# EAGLE design SUSTAINA-SBC-Power-Board (EAGLE 9.6.2)
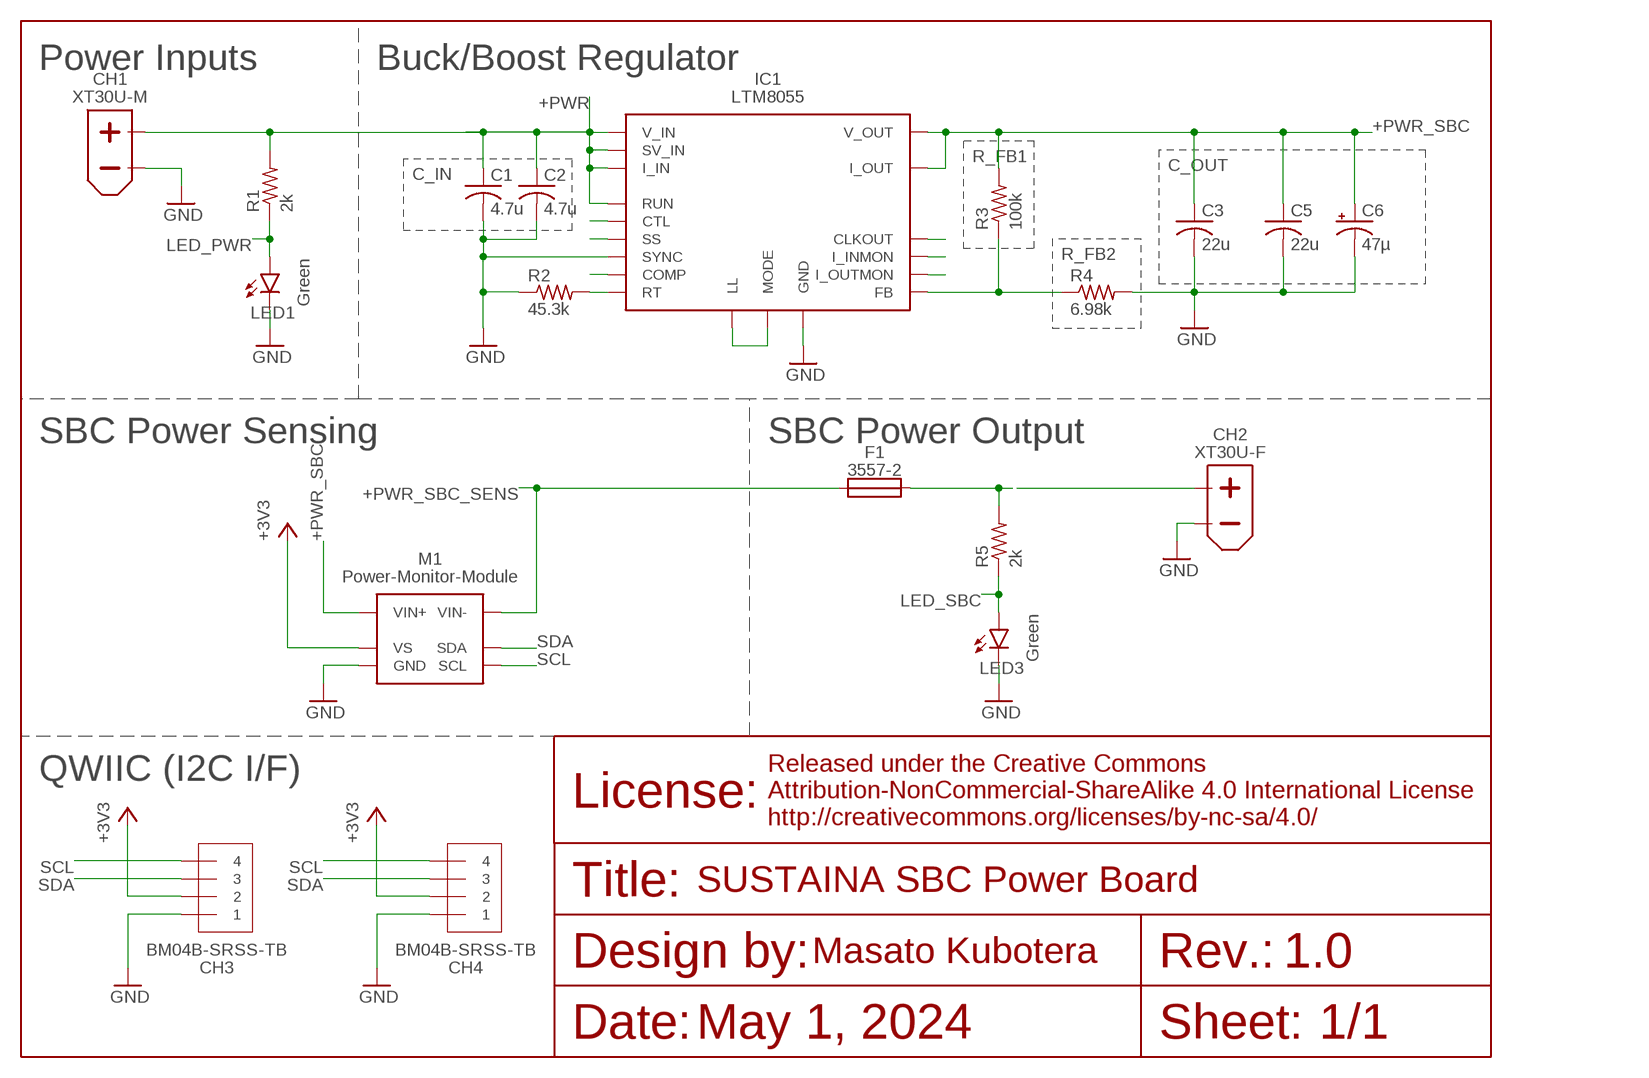
[diagram p0: schematic, sheet 1]

## Parts
C1  4.7u  C-USC0805  [C0805]
C2  4.7u  C-USC0805  [C0805]
C3  22u  C-USC0805  [C0805]
C5  22u  C-USC0805  [C0805]
C6  47µ  CPOL-USD/7343-31R  [D/7343-31R]
CH1  XT30U-M  [XT30U-M]
CH2  XT30U-F  [XT30U-F]
CH3  BM04B-SRSS-TB  [BM04B-SRSS-TB]
CH4  BM04B-SRSS-TB  [BM04B-SRSS-TB]
F1  3557-2  [3557-2]
IC1  LTM8055  [LTM8055]
LED1  Green  LEDSML0603  [SML0603]
LED3  Green  LEDSML0603  [SML0603]
M1  POWER-MONITOR-MODULE  [POWER-MONITOR-MODULE]
R1  2k  R-US_R0603  [R0603]
R2  45.3k  R-US_R0603  [R0603]
R3  100k  R-US_R0603  [R0603]
R4  6.98k  R-US_R0603  [R0603]
R5  2k  R-US_R0603  [R0603]

## Nets
+3V3 [low-power]: CH3.2 CH4.2 M1.VS
+PWR [power]: C1.1 C2.1 CH1.+ IC1.F10(SV_IN) IC1.F11(SV_IN) IC1.G10(V_IN) IC1.G11(V_IN) IC1.H10(V_IN) IC1.H11(V_IN) IC1.J10(V_IN) IC1.J11(V_IN) IC1.K10(V_IN) IC1.K11(V_IN) IC1.L4(RUN) IC1.L9(I_IN) IC1.L10(V_IN) IC1.L11(V_IN) R1.2
+PWR_SBC [power]: C3.1 C5.1 C6.+ IC1.A1(V_OUT) IC1.A2(V_OUT) IC1.A3(V_OUT) IC1.A4(V_OUT) IC1.A5(V_OUT) IC1.A6(V_OUT) IC1.B1(V_OUT) IC1.B2(V_OUT) IC1.B3(V_OUT) IC1.B4(V_OUT) IC1.B5(V_OUT) IC1.B6(V_OUT) IC1.C1(V_OUT) IC1.C2(V_OUT) IC1.C3(V_OUT) IC1.C4(V_OUT) IC1.C5(V_OUT) IC1.C6(V_OUT) IC1.D1(I_OUT) M1.VIN+1(VIN+) M1.VIN+2(VIN+) M1.VIN+3(VIN+) M1.VIN+4(VIN+) M1.VIN+5(VIN+) M1.VIN+6(VIN+) M1.VIN+7(VIN+) M1.VIN+8(VIN+) M1.VIN+9(VIN+) M1.VIN+10(VIN+) R3.2
+PWR_SBC_OUT [power]: CH2.+ F1.3 F1.4 R5.2
+PWR_SBC_SENS [power]: F1.1 F1.2 M1.VIN-1(VIN-) M1.VIN-2(VIN-) M1.VIN-3(VIN-) M1.VIN-4(VIN-) M1.VIN-5(VIN-) M1.VIN-6(VIN-) M1.VIN-7(VIN-) M1.VIN-8(VIN-) M1.VIN-9(VIN-) M1.VIN-10(VIN-)
CLKOUT [signal]: IC1.G1(CLKOUT)
COMP [signal]: IC1.J2(COMP)
FB [signal]: IC1.J1(FB) R3.1 R4.1
GND [power]: C1.2 C2.2 C3.2 C5.2 C6.- CH1.- CH2.- CH3.1 CH4.1 IC1.A7(GND) IC1.A8(GND) IC1.A9(GND) IC1.A10(GND) IC1.A11(GND) IC1.B7(GND) IC1.B8(GND) IC1.B9(GND) IC1.B10(GND) IC1.B11(GND) IC1.C7(GND) IC1.C8(GND) IC1.C9(GND) IC1.C10(GND) IC1.C11(GND) IC1.D2(GND) IC1.D3(GND) IC1.D4(GND) IC1.D5(GND) IC1.D6(GND) IC1.D7(GND) IC1.D8(GND) IC1.D9(GND) IC1.D10(GND) IC1.D11(GND) IC1.E1(GND) IC1.E2(GND) IC1.E3(GND) IC1.E4(GND) IC1.E5(GND) IC1.E6(GND) IC1.E7(GND) IC1.E8(GND) IC1.E9(GND) IC1.E10(GND) IC1.E11(GND) IC1.F2(GND) IC1.F3(GND) IC1.F4(GND) IC1.F5(GND) IC1.F6(GND) IC1.F7(GND) IC1.F8(GND) IC1.F9(GND) IC1.G3(GND) IC1.G4(GND) IC1.G5(GND) IC1.G6(GND) IC1.G7(GND) IC1.G8(GND) IC1.G9(GND) IC1.H2(SYNC) IC1.H3(GND) IC1.H4(GND) IC1.H5(GND) IC1.H6(GND) IC1.H7(GND) IC1.H8(GND) IC1.H9(GND) IC1.J3(GND) IC1.J4(GND) IC1.J5(GND) IC1.J6(GND) IC1.J7(GND) IC1.J8(GND) IC1.J9(GND) IC1.K3(GND) IC1.K4(GND) IC1.K5(GND) IC1.K6(GND) IC1.K7(GND) IC1.K8(GND) IC1.K9(GND) IC1.L1(GND) IC1.L5(GND) IC1.L6(GND) IC1.L7(GND) IC1.L8(GND) LED1.C LED3.C M1.GND R2.1 R4.2
I_INMON [signal]: IC1.L3(I_INMON)
I_OUTMON [signal]: IC1.L2(I_OUTMON)
LED_PWR [low-power]: LED1.A R1.1
LED_SBC [low-power]: LED3.A R5.1
MODE [signal]: IC1.F1(LL) IC1.G2(MODE)
RT [signal]: IC1.H1(RT) R2.2
SCL [signal]: CH3.4 CH4.4 M1.SCL
SDA [signal]: CH3.3 CH4.3 M1.SDA
SS [signal]: IC1.K1(SS)
STL [signal]: IC1.K2(CTL)

## Notes on the sheet
- Power Inputs | Buck/Boost Regulator
- R_FB1
- C_OUT
- C_IN
- R_FB2
- SBC Power Sensing | SBC Power Output
- QWIIC (I2C I/F)
- SUSTAINA SBC Power Board
- 1.0
- May 1, 2024 | 1/1

## Library data of the parts
C1-C3 C5 = rcl:C-US: CAPACITOR, American symbol; SPICEPREFIX: C
C6 = rcl:CPOL-US: POLARIZED CAPACITOR, American symbol; SPICEPREFIX: C
CH1 = XT30:XT30U-M
CH2 = XT30:XT30U-F
CH3 CH4 = SH-Connecters:BM04B-SRSS-TB
F1 = 3557-2:3557-2
IC1 = LTM8055:LTM8055
LED1 LED3 = led:LED: LED OSRAM: - CHIPLED LG R971, LG N971, LY N971, LG Q971, LY Q971, LO R971, LY R971 LH N974, LH R974 LS Q976, LO Q976, LY Q976 LO Q996 - Hyper CHIPLED LW Q18S LB Q993, LB Q99A, LB R99A - SideLED LS A670, LO A670, LY A670, LG A670, LP A670 LB A673, LV A673, LT A673, LW A673 LH A674 LY A675 LS A676, LA A676, LO A676, LY A676, LW A676 LS A679, LY A679, LG A679 - Hyper Micro SIDELED® LS Y876, LA Y876, LO Y876, LY Y876 LT Y87S - SmartLED LW L88C, LW L88S LB L89C, LB L89S, LG L890 LS L89K, LO L89K, LY L89K LS L896, LA L896, LO L896, LY L896 - TOPLED LS T670, LO T670, LY T670, LG T670, LP T670 LSG T670, LSP T670, LSY T670, LOP T670, LYG T670 LG T671, LOG T671, LSG T671 LB T673, LV T673, LT T673, LW T673 LH T674 LS T676, LA T676, LO T676, LY T676, LB T676, LH T676, LSB T676, LW T676 LB T67C, LV T67C, LT T67C, LS T67K, LO T67K, LY T67K, LW E67C LS E67B, LA E67B, LO E67B, LY E67B, LB E67C, LV E67C, LT E67C LW T67C LS T679, LY T679, LG T679 LS T770, LO T770, LY T770, LG T770, LP T770 LB T773, LV T773, LT T773, LW T773 LH T774 LS E675, LA E675, LY E675, LS T675 LS T776, LA T776, LO T776, LY T776, LB T776 LHGB T686 LT T68C, LB T68C - Hyper Mini TOPLED® LB M676 - Mini TOPLED Santana® LG M470 LS M47K, LO M47K, LY M47K Source: http://www.osram.convergy.de LUXEON: - LUMILED® LXK2-PW12-R00, LXK2-PW12-S00, LXK2-PW14-U00, LXK2-PW14-V00 LXK2-PM12-R00, LXK2-PM12-S00, LXK2-PM14-U00 LXK2-PE12-Q00, LXK2-PE12-R00, LXK2-PE12-S00, LXK2-PE14-T00, LXK2-PE14-U00 LXK2-PB12-K00, LXK2-PB12-L00, LXK2-PB12-M00, LXK2-PB14-N00, LXK2-PB14-P00, LXK2-PB14-Q00 LXK2-PR12-L00, LXK2-PR12-M00, LXK2-PR14-Q00, LXK2-PR14-R00 LXK2-PD12-Q00, LXK2-PD12-R00, LXK2-PD12-S00 LXK2-PH12-R00, LXK2-PH12-S00 LXK2-PL12-P00, LXK2-PL12-Q00, LXK2-PL12-R00 Source: www.luxeon.com KINGBRIGHT: KA-3528ASYC Source: www.kingbright.com
M1 = Power-Monitor-Module:POWER-MONITOR-MODULE
R1-R5 = rcl:R-US_: RESISTOR, American symbol; SPICEPREFIX: R

## Net classes
0 default: width 0.203 mm, drill 0.35 mm, clearance 0.203 mm
1 signal: width 0.203 mm, clearance 0.127 mm
2 power: width 0.254 mm, clearance 0.127 mm
3 low-power: width 0.254 mm

## Board
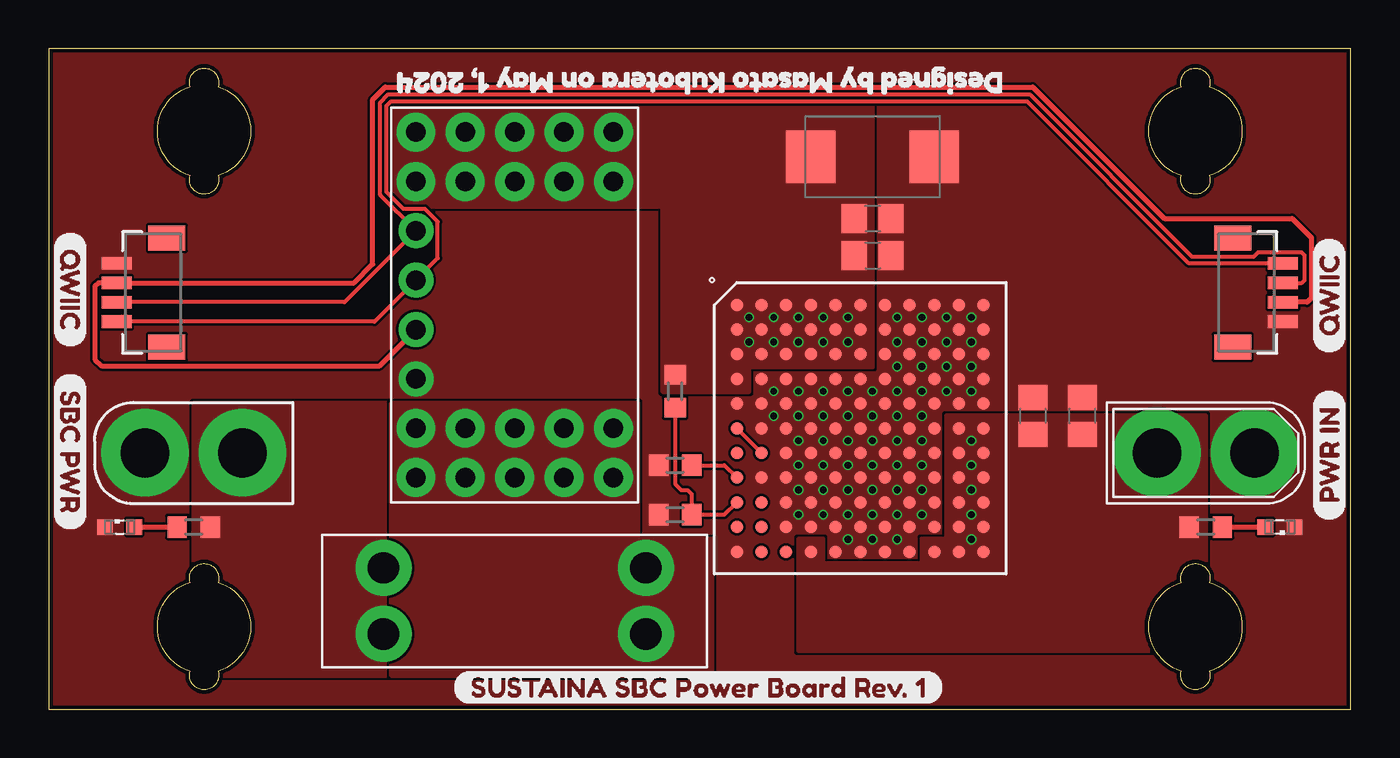
[diagram p1: board, top side]
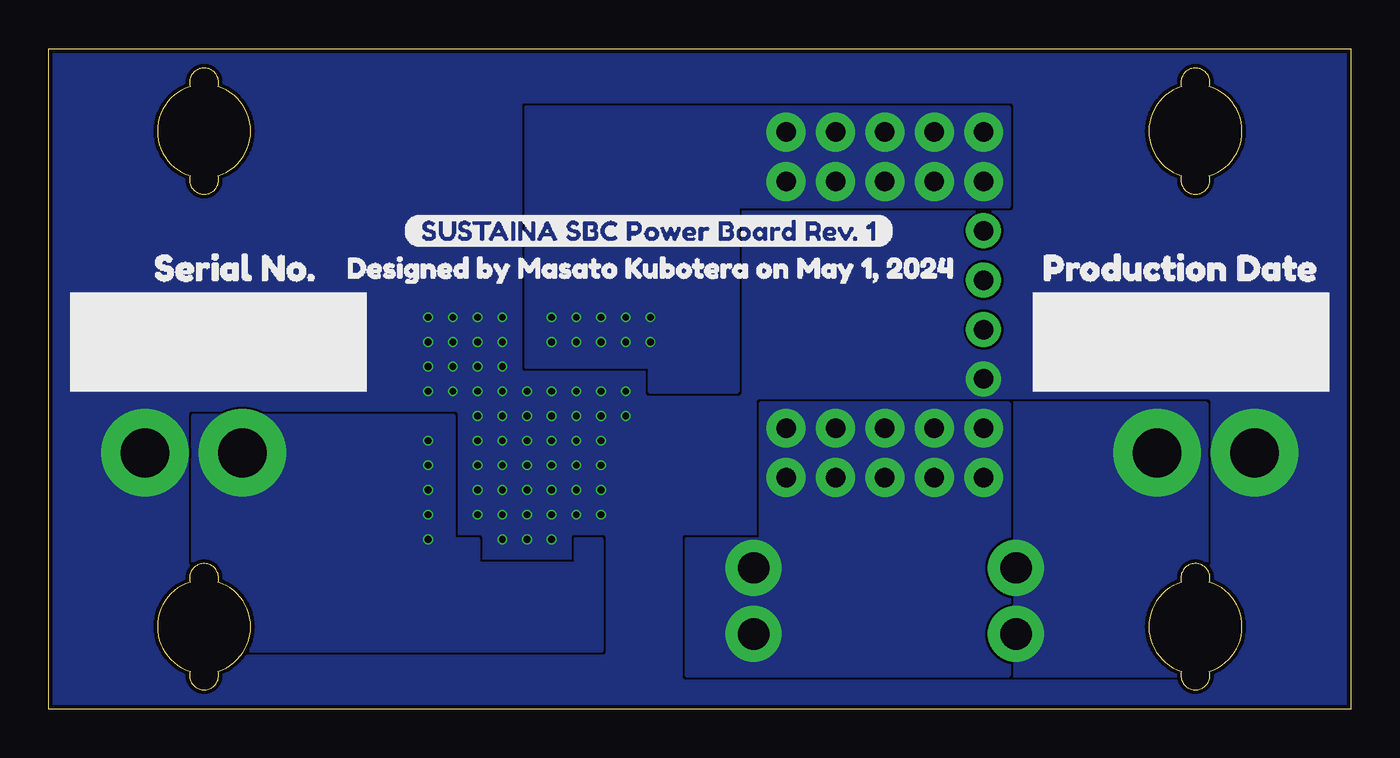
[diagram p2: board, bottom side, seen from below]

Size 67 x 34 mm. Coordinates in mm from the lower left corner, seen from the top.
Outline: 67,34 0,34 0,0 67,0 67,34
Outline: 8.72,1.96 arc-213 7.28,1.96 arc-145 7.28,6.54 arc-213 8.72,6.54 arc-145 8.72,1.96
Outline: 59.72,1.96 arc-213 58.28,1.96 arc-145 58.28,6.54 arc-213 59.72,6.54 arc-145 59.72,1.96
Outline: 58.28,32.04 arc-213 59.72,32.04 arc-145 59.72,27.46 arc-213 58.28,27.46 arc-145 58.28,32.04
Outline: 7.28,32.04 arc-213 8.72,32.04 arc-145 8.72,27.46 arc-213 7.28,27.46 arc-145 7.28,32.04
Copper layers (1*16): Top 0.035mm / dielectric 1.6mm / Bottom 0.035mm
Design rules "jlcpcb-2layers": minimum track width 5mil, minimum drill 0.3mm, track to track 5mil, track to pad 5mil, pad to pad 5mil, via to via 5mil, smd to smd 5mil, copper to edge 0.2mm, drill to drill 6mil, minimum pad ring 10mil, minimum via ring 3mil, stop-mask expansion 4mil, vias tented up to drill 0mil, thermal gap 10mil

### Footprints (pad centres in the part's own frame; a part is rotated, then mirrored left to right if it is on the bottom)
C0805 = smd 1.3 x 1.5: 1 -0.95,0; 2 0.95,0
D/7343-31R = smd 2.55 x 2.7: + 3.175,0; - -3.175,0
XT30U-M = drill 2.5 pad 4.5: + 2.5,0; - -2.5,0
XT30U-F = drill 2.5 pad 4.5: + 2.5,0; - -2.5,0
BM04B-SRSS-TB = smd 0.66 x 1.549: 1 1.5,3.33; 2 0.5,3.33; 3 -0.5,3.33; 4 -1.5,3.33 | smd 1.295 x 1.905: 5 2.8,0.75; 6 -2.8,0.75
3557-2 = drill 1.6: 1 -6.75,1.7; 2 -6.75,-1.7; 3 6.75,1.7; 4 6.75,-1.7
LTM8055 = smd 0.635 x 0.635: A1 -6.35,6.35; A2 -5.08,6.35; A3 -3.81,6.35; A4 -2.54,6.35; A5 -1.27,6.35; A6 0,6.35; A7 1.27,6.35; A8 2.54,6.35; A9 3.81,6.35; A10 5.08,6.35; A11 6.35,6.35; B1 -6.35,5.08; B2 -5.08,5.08; B3 -3.81,5.08; B4 -2.54,5.08; B5 -1.27,5.08; B6 0,5.08; B7 1.27,5.08; B8 2.54,5.08; B9 3.81,5.08; B10 5.08,5.08; B11 6.35,5.08; C1 -6.35,3.81; C2 -5.08,3.81; C3 -3.81,3.81; C4 -2.54,3.81; C5 -1.27,3.81; C6 0,3.81; C7 1.27,3.81; C8 2.54,3.81; C9 3.81,3.81; C10 5.08,3.81; C11 6.35,3.81; D1 -6.35,2.54; D2 -5.08,2.54; D3 -3.81,2.54; D4 -2.54,2.54; D5 -1.27,2.54; D6 0,2.54; D7 1.27,2.54; D8 2.54,2.54; D9 3.81,2.54; D10 5.08,2.54; D11 6.35,2.54; E1 -6.35,1.27; E2 -5.08,1.27; E3 -3.81,1.27; E4 -2.54,1.27; E5 -1.27,1.27; E6 0,1.27; E7 1.27,1.27; E8 2.54,1.27; E9 3.81,1.27; E10 5.08,1.27; E11 6.35,1.27; F1 -6.35,0; F2 -5.08,0; F3 -3.81,0; F4 -2.54,0; F5 -1.27,0; F6 0,0; F7 1.27,0; F8 2.54,0; F9 3.81,0; F10 5.08,0; F11 6.35,0; G1 -6.35,-1.27; G2 -5.08,-1.27; G3 -3.81,-1.27; G4 -2.54,-1.27; G5 -1.27,-1.27; G6 0,-1.27; G7 1.27,-1.27; G8 2.54,-1.27; G9 3.81,-1.27; G10 5.08,-1.27; G11 6.35,-1.27; H1 -6.35,-2.54; H2 -5.08,-2.54; H3 -3.81,-2.54; H4 -2.54,-2.54; H5 -1.27,-2.54; H6 0,-2.54; H7 1.27,-2.54; H8 2.54,-2.54; H9 3.81,-2.54; H10 5.08,-2.54; H11 6.35,-2.54; J1 -6.35,-3.81; J2 -5.08,-3.81; J3 -3.81,-3.81; J4 -2.54,-3.81; J5 -1.27,-3.81; J6 0,-3.81; J7 1.27,-3.81; J8 2.54,-3.81; J9 3.81,-3.81; J10 5.08,-3.81; J11 6.35,-3.81; K1 -6.35,-5.08; K2 -5.08,-5.08; K3 -3.81,-5.08; K4 -2.54,-5.08; K5 -1.27,-5.08; K6 0,-5.08; K7 1.27,-5.08; K8 2.54,-5.08; K9 3.81,-5.08; K10 5.08,-5.08; K11 6.35,-5.08; L1 -6.35,-6.35; L2 -5.08,-6.35; L3 -3.81,-6.35; L4 -2.54,-6.35; L5 -1.27,-6.35; L6 0,-6.35; L7 1.27,-6.35; L8 2.54,-6.35; L9 3.81,-6.35; L10 5.08,-6.35; L11 6.35,-6.35
SML0603 = smd 0.8 x 0.8: A 0.75,0; C -0.75,0
POWER-MONITOR-MODULE = drill 1: GND 13.97,-11.43; SCL 8.89,-11.43; SDA 6.35,-11.43; VS 11.43,-11.43 | drill 1 pad 2: VIN+1 1.27,-1.27; VIN+2 3.81,-1.27; VIN+3 1.27,-3.81; VIN+4 3.81,-3.81; VIN+5 1.27,-6.35; VIN+6 3.81,-6.35; VIN+7 1.27,-8.89; VIN+8 3.81,-8.89; VIN+9 1.27,-11.43; VIN+10 3.81,-11.43; VIN-1 16.51,-1.27; VIN-2 19.05,-1.27; VIN-3 16.51,-3.81; VIN-4 19.05,-3.81; VIN-5 16.51,-6.35; VIN-6 19.05,-6.35; VIN-7 16.51,-8.89; VIN-8 19.05,-8.89; VIN-9 16.51,-11.43; VIN-10 19.05,-11.43
R0603 = smd 1 x 1.1: 1 -0.85,0; 2 0.85,0

### Placement (x,y rotation side)
C1  50.64,15.1 90 top
C2  53.19,15.1 90 top
C3  42.39,25.26 0 top
C5  42.39,23.35 0 top
C6  42.39,28.43 180 top
CH1  59.53,13.19 180 top
CH2  7.46,13.19 0 top
CH3  6.83,21.45 90 top
CH4  60.17,21.45 270 top
F1  23.98,5.57 180 top
IC1  41.76,14.46 0 top
LED1  63.34,9.38 180 top
LED3  3.66,9.38 0 top
M1  30.32,30.97 270 top
R1  59.53,9.38 180 top
R2  32.23,12.55 0 top
R3  32.23,16.36 90 top
R4  32.23,10.02 180 top
R5  7.46,9.38 0 top
U$1  [PWR_IN]  65.88,9.7 90 top
U$2  [SBC_PWR]  1.12,17.32 270 top
U$3  [QWIIC]  65.88,18.27 90 top
U$4  [QWIIC]  1.12,24.62 270 top
U$5  [DESIGNED_BY_MASATO_KUBOTERA_ON_MAY_1]  50.01,32.24 180 top
U$6  [SUSTAINA_SBC_POWER_BOARD_REV#_1]  20.8,1.12 0 top
U$7  [DESIGNED_BY_MASATO_KUBOTERA_ON_MAY_1]  52.55,22.71 0 bottom
U$8  [SUSTAINA_SBC_POWER_BOARD_REV#_1]  48.74,24.62 0 bottom
U$9  PRODUCTION_DATE0  [PRODUCTION_DATE0]  16.99,22.71 0 bottom
U$10  SERIAL_NO#0  [SERIAL_NO#0]  62.71,22.71 0 bottom

### Tracks (layer width: path | path; a pad name or v marks a point on that pad's centre or on a via)
+3V3
  Top 0.254: M1.VS 17.02,17.67 2.73,17.67 2.39,18.01 2.39,21.76 2.57,21.95 CH3.2 15.72,21.95 16.67,22.9 16.67,31.38 17.32,32.02 50.63,32.02 57.4,25.26 63.98,25.26 64.97,24.26 64.97,21.17 64.75,20.95 CH4.2
+PWR  (via drill 0.35)
  other vias: 47.47,13.82 47.47,12.55 47.47,11.29 47.47,10.02 47.47,8.74
  pour Top (no thermals): 38.58,8.74 38.58,3.03 59.53,3.03 59.53,15.1 46.2,15.1 46.2,8.74 44.93,8.74 44.93,7.47 39.85,7.47 39.85,8.74
  pour Bottom (no thermals): 38.58,8.74 38.58,3.03 59.53,3.03 59.53,15.1 46.2,15.1 46.2,8.74 44.93,8.74 44.93,7.47 39.85,7.47 39.85,8.74
+PWR_SBC  (via drill 0.35)
  other vias: 36.04,20.18 37.31,20.18 38.58,20.18 39.85,20.18 41.12,20.18 36.04,18.91 37.31,18.91 38.58,18.91 39.85,18.91 41.12,18.91
  pour Top (no thermals): 17.62,30.97 17.62,25.89 31.59,25.89 31.59,16.36 36.04,16.36 36.04,17.64 42.39,17.64 42.39,30.97
  pour Bottom (no thermals): 17.62,30.97 17.62,25.89 31.59,25.89 31.59,16.36 36.04,16.36 36.04,17.64 42.39,17.64 42.39,30.97
+PWR_SBC_OUT
  pour Top (rank 2, no thermals): 7.46,15.73 7.46,1.76 19.53,1.76 19.53,15.73
  pour Bottom (rank 2, no thermals): 7.46,15.73 7.46,1.76 19.53,1.76 19.53,15.73
+PWR_SBC_SENS
  pour Top (no thermals): 17.62,15.73 17.62,1.76 34.13,1.76 34.13,8.74 30.32,8.74 30.32,15.73
  pour Bottom (no thermals): 17.62,15.73 17.62,1.76 34.13,1.76 34.13,8.74 30.32,8.74 30.32,15.73
FB
  Top 0.203: IC1.J1 34.77,10.02 R4.1 | R3.1 32.23,11.6 32.55,11.29 32.87,11.29 33.08,11.07 R4.1 | 33.5,10.02 R4.1
GND  (via drill 0.35)
  other vias: 42.39,16.36 43.66,20.18 44.93,20.18 46.2,20.18 47.47,20.18 47.47,18.91 46.2,18.91 44.93,18.91 43.66,18.91 47.47,17.64 46.2,17.64 44.93,17.64 43.66,17.64 47.47,16.36 46.2,16.36 44.93,16.36 43.66,16.36 41.12,16.36 39.85,16.36 38.58,16.36 37.31,16.36 44.93,15.1 43.66,15.1 42.39,15.1 41.12,15.1 39.85,15.1 38.58,15.1 37.31,15.1 44.93,13.82 43.66,13.82 42.39,13.82 41.12,13.82 39.85,13.82 38.58,13.82 43.66,8.74 42.39,8.74 41.12,8.74 44.93,12.55 43.66,12.55 42.39,12.55 41.12,12.55 39.85,12.55 38.58,12.55 44.93,11.29 43.66,11.29 42.39,11.29 41.12,11.29 39.85,11.29 38.58,11.29 44.93,10.02 43.66,10.02 42.39,10.02 41.12,10.02 39.85,10.02 38.58,10.02
  pour Top (rank 6, no thermals): -2.06,-0.78 69.06,-0.78 69.06,34.78 -2.06,34.78
  pour Bottom (rank 6, no thermals): -4.6,-3.32 71.6,-3.32 71.6,37.32 -4.6,37.32
LED_PWR
  Top 0.254: R1.1 LED1.A 62.71,9.38
LED_SBC
  Top 0.254: 4.39,9.38 LED3.A R5.1
MODE
  Top 0.203: IC1.F1 IC1.G2
RT
  Top 0.203: IC1.H1 34.77,12.55 R2.2
SCL
  Top 0.203: CH3.4 16.76,19.95 M1.SCL 20.02,23.21 20.02,25.09 19.36,25.75 18.26,25.75 17.39,26.62 17.39,31.05 17.62,31.29 50.33,31.29 58.67,22.95 CH4.4
SDA
  Top 0.203: CH3.3 15.22,20.95 M1.SDA 17.06,26.46 17.06,31.22 17.48,31.64 50.48,31.64 58.83,23.29 62,23.29 62.21,23.5 64.46,23.5 64.61,23.35 64.61,22.08 64.48,21.95 CH4.3